# Altium project Sayma_AMC.PrjPcb (part 18 of 18)
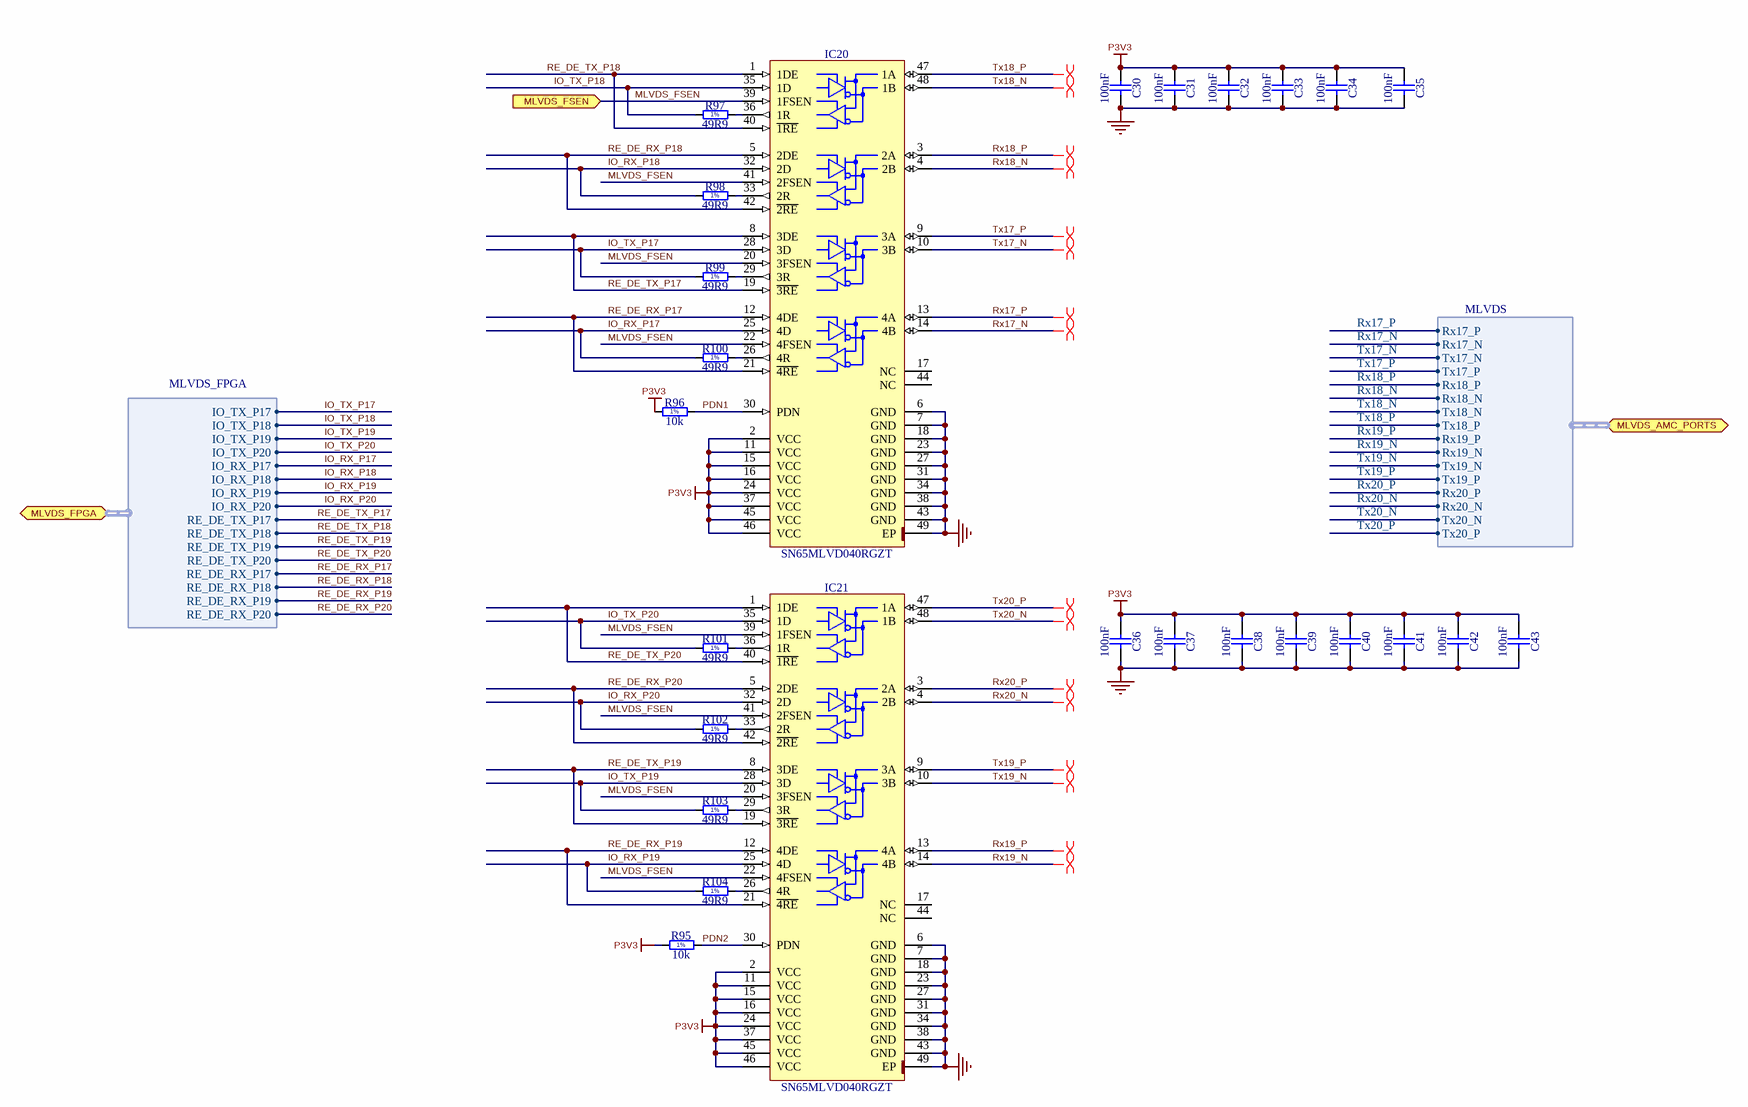
[diagram p33: M-LVDS_PHY.SchDoc]

## Nets that join several sheets (continued)
SFP2_RATE_SELECT: SFP (IC32A.4 R183A.1), FPGA_Banks_64_65_HR (IC37.AL12)
SFP2_TX_DISABLE: SFP (IC32A.2 R182A.1), FPGA_Banks_64_65_HR (IC37.AM12)
SFP2_TX_FAULT: SFP (IC32A.9), FPGA_Banks_64_65_HR (IC37.AN12)
SI5324_INT_ALM: SI5324_CDR_WR_oscillators (IC43.3), FPGA_Banks_64_65_HR (IC37.L22)
SI5324_RST: SI5324_CDR_WR_oscillators (IC43.1), FPGA_Banks_64_65_HR (IC37.L24)
SMA0_IO_TTL: Sayma_AMC (J1.1), DUAL_IO_TTL_BUFFER (IC52.3 IC52.5)
SMA1_IO_TTL: Sayma_AMC (J2.1), DUAL_IO_TTL_BUFFER (IC52.8 IC52.12)
SMA_IO0: DUAL_IO_TTL_BUFFER (R446.1), FPGA_Banks_64_65_HR (IC37.P26)
SMA_IO0_DIR: DUAL_IO_TTL_BUFFER (IC52.4 R451.2 T19.1), FPGA_Banks_64_65_HR (IC37.K25)
SMA_IO1: DUAL_IO_TTL_BUFFER (R447.1), FPGA_Banks_64_65_HR (IC37.N24)
SMA_IO1_DIR: DUAL_IO_TTL_BUFFER (IC52.13 R450.2 T20.1), FPGA_Banks_64_65_HR (IC37.L23)
TCLKA_N: AMC_Connector (J5.75), SI5324_CDR_WR_oscillators (C268.1)
TCLKA_P: AMC_Connector (J5.74), SI5324_CDR_WR_oscillators (C265.1)
TCLKB_N: AMC_Connector (J5.78), SI5324_CDR_WR_oscillators (C272.1 C376.2)
TCLKB_P: AMC_Connector (J5.77), SI5324_CDR_WR_oscillators (C270.1 C375.2)
Tx0_N: AMC_Connector (J5.12), ETH_PHY_RGMII (C169.1 C185.1 J14.3)
Tx0_P: AMC_Connector (J5.11), ETH_PHY_RGMII (C168.1 C184.1 J14.2)
Tx4_N: AMC_Connector (J5.45), FPGA_Banks_224_225_226_227_228 (C294.2 J16.3)
Tx4_P: AMC_Connector (J5.44), FPGA_Banks_224_225_226_227_228 (C293.2 J16.2)
Tx5_N: AMC_Connector (J5.51), FPGA_Banks_44_45_46_DDR64 (C231.2), FPGA_Banks_224_225_226_227_228 (C292.2 J17.3)
Tx5_P: AMC_Connector (J5.50), FPGA_Banks_44_45_46_DDR64 (C232.2), FPGA_Banks_224_225_226_227_228 (C291.2 J17.2)
Tx17_N: AMC_Connector (J5.144), M-LVDS_PHY (IC20.10)
Tx17_P: AMC_Connector (J5.145), M-LVDS_PHY (IC20.9)
Tx18_N: AMC_Connector (J5.150), M-LVDS_PHY (IC20.48)
Tx18_P: AMC_Connector (J5.151), M-LVDS_PHY (IC20.47)
Tx19_N: AMC_Connector (J5.156), M-LVDS_PHY (IC21.10)
Tx19_P: AMC_Connector (J5.157), M-LVDS_PHY (IC21.9)
Tx20_N: AMC_Connector (J5.162), M-LVDS_PHY (IC21.48)
Tx20_P: AMC_Connector (J5.163), M-LVDS_PHY (IC21.47)
USB_JTAG_ACTIVE: USB_SERIAL_QUAD (R45.2), JTAG_Configuration (T6.1)
USB_TCK: USB_SERIAL_QUAD (IC11.4), JTAG_Configuration (R50.2)
USB_TDI: USB_SERIAL_QUAD (IC11.5), JTAG_Configuration (R51.2)
USB_TDO: USB_SERIAL_QUAD (IC12.4), JTAG_Configuration (R52.2)
USB_TMS: USB_SERIAL_QUAD (IC12.5), JTAG_Configuration (R53.2)
Vbias_0.9V: FPGA_Banks_47_48_HP_FMC (7 pins), FPGA_Bank_66_HP (6 pins)
WR_REF_CLK_IN_N: SI5324_CDR_WR_oscillators (C272.2 C273.2), FPGA_Bank_66_HP (IC37.J10 R351.2 R530.1)
WR_REF_CLK_IN_P: SI5324_CDR_WR_oscillators (C270.2 C271.2), FPGA_Bank_66_HP (IC37.K10 R350.2 R530.2)

## Assembly variants
Default: not fitted C160 C161 C162 C163 C164 C165 C166 C167 C168 C169 C221 C222 C223 C224 C225 C226 C227 C228 C233 C234 C235 C236 C239 C240 C241 C242 C245 C246 C248 C249 C252 C253 C254 C255 C263 C264 C265 C268 C270 C272 C277 C281 C282 C291 C292 C327 C328 C347 C348 C349 C352 C571 C573 C575 C577 C639 C640 C641 C642 C659 C660 C661 C662 C663 C664 C665 C666 C667 C668 C674 C675 C678 C679 C680 C681 IC2 IC57 IC58 L25 L32 L33 L34 L35 MOD? OSC2 R58 R59 R60 R61 R62 R180A R180B R181A R181B R216 R223 R224 R225 R226 R227 R233 R246 R247 R248 R251 R253 R261 R262 R263 R294 R295 R344 R345 R359 R360 R375 R379 R382 R383 R386 R389 R419 R420 R421 R486 R494 R509 R524 R526 R528 R530 R538 R539 R540 R541 R549 R551 R555 R560 R563 R566 T24 T25 T26 T27 W11